# Altium schematic sheet Power_Regulation.SchDoc
size A3; CompanyName: Group 19 - AIgle; DrawnBy: Danny Huang; SheetNumber: 3; SheetTotal: 3
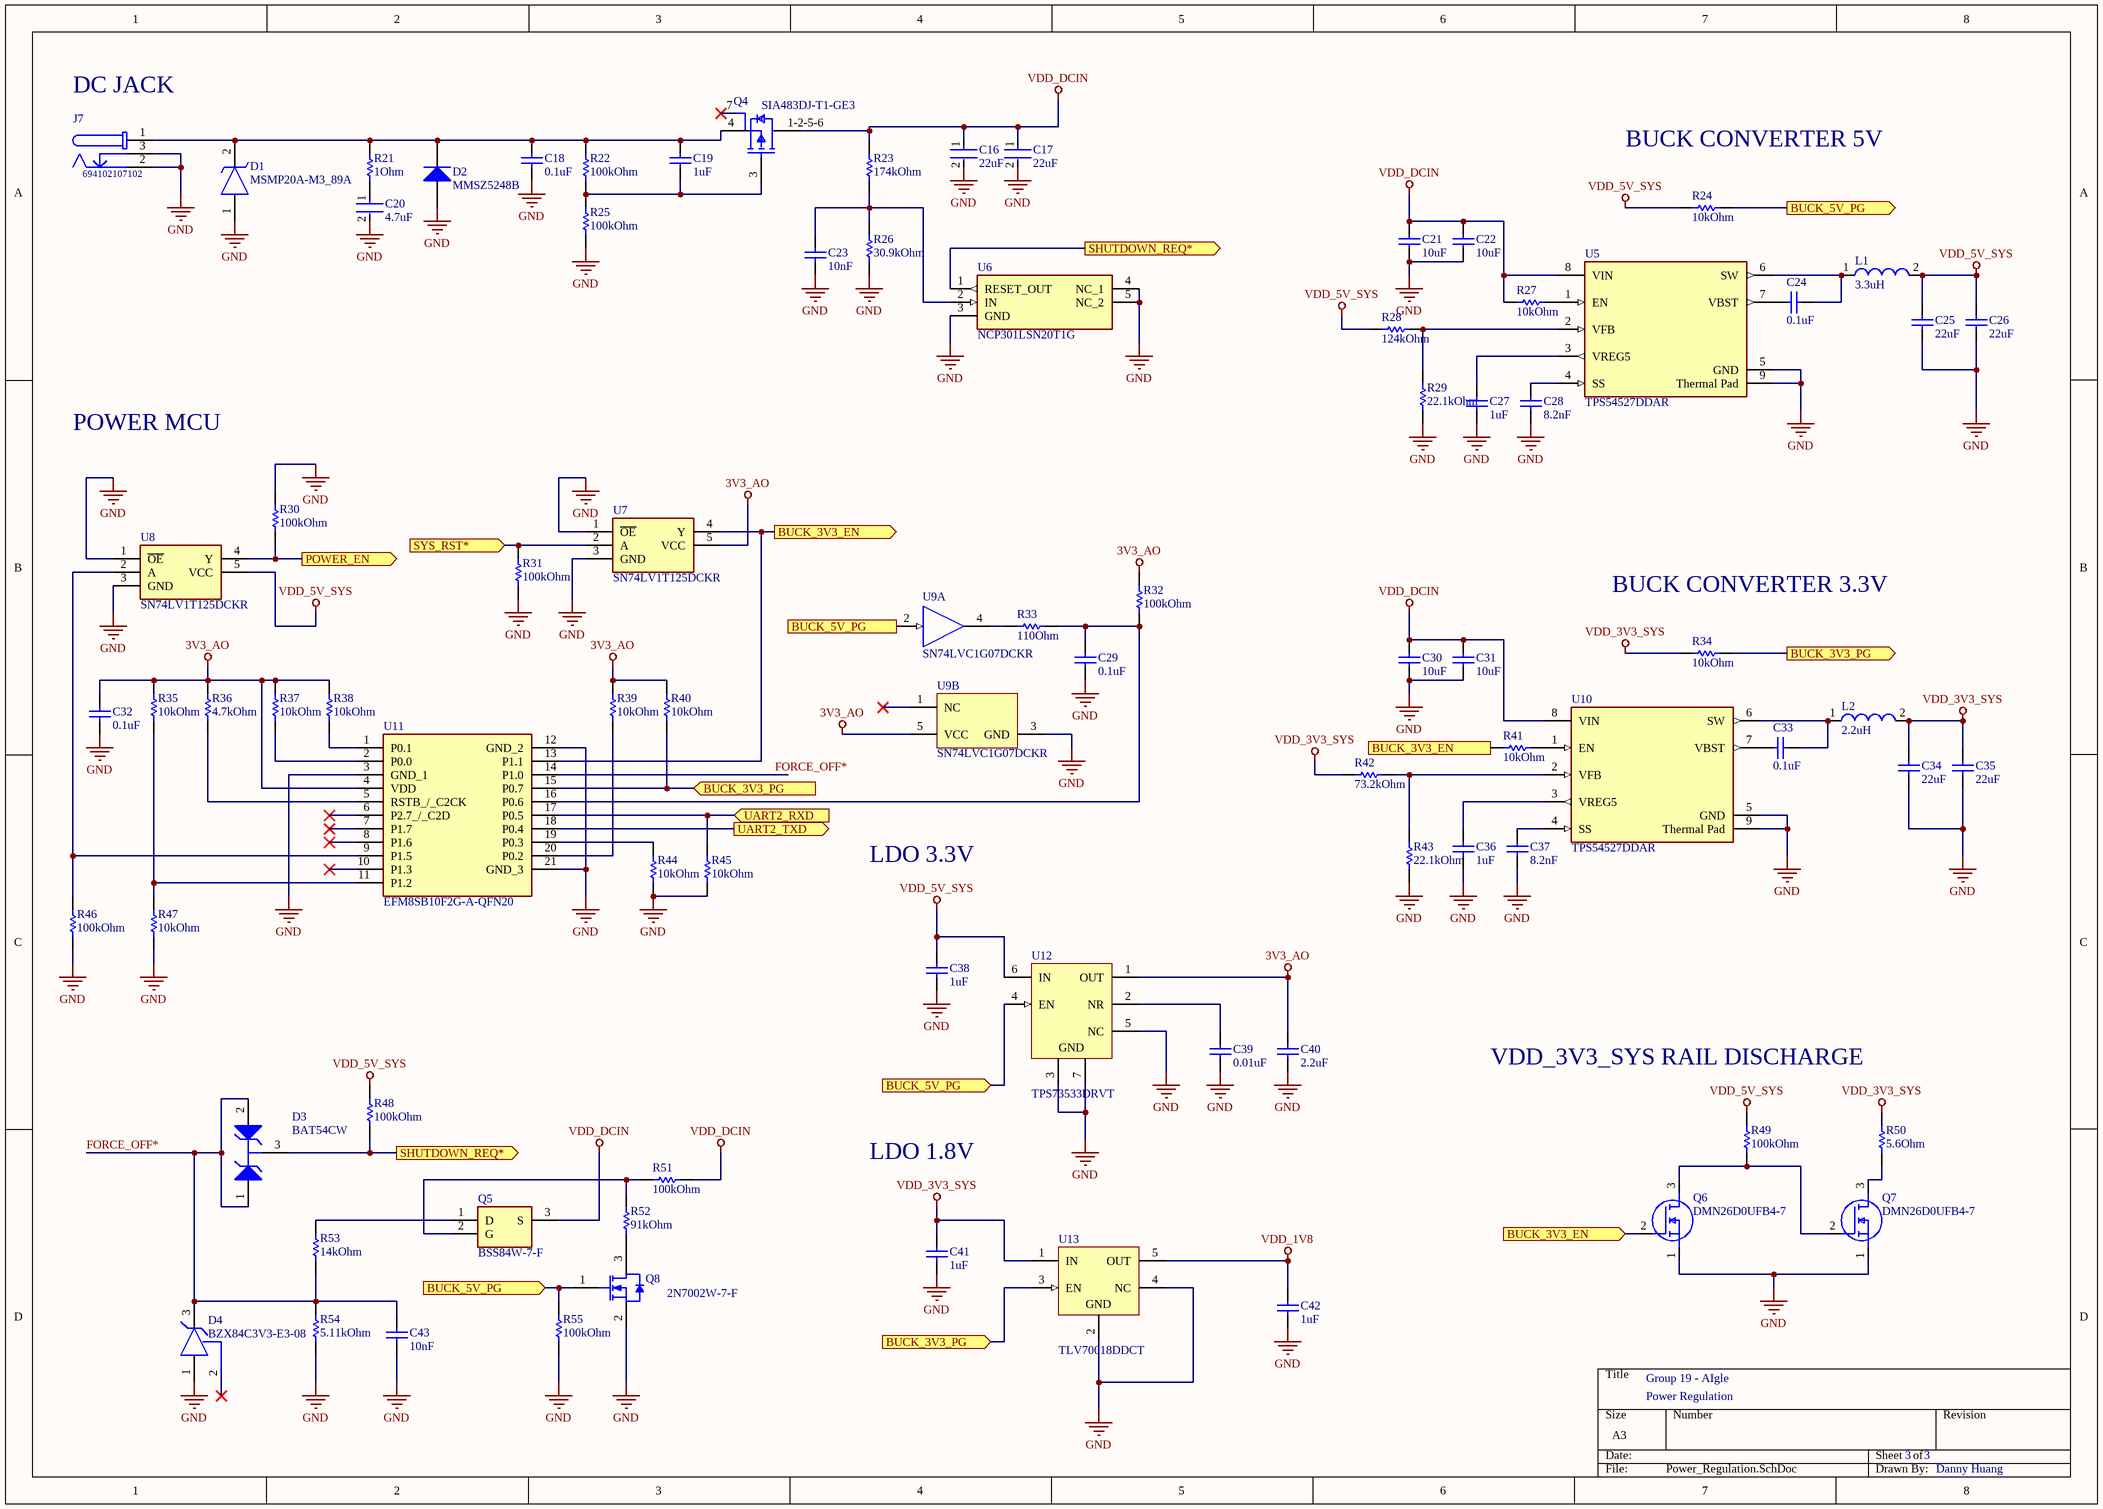
[diagram p0: Power_Regulation.SchDoc]

## Parts
C16  22uF  [FP-GRM21-0_2-MFG]
C17  22uF  [FP-GRM21-0_2-MFG]
C18  0.1uF  [CAPC1005X55X30NL05T10]
C19  1uF  [CAPC1608X90X35LL10T15]
C20  4.7uF  [FP-C0603-CG-MFG]
C21  10uF  [CAPC1608X90X35NL10T15]
C22  10uF  [CAPC1608X90X35NL10T15]
C23  10nF  [CAPC1005X55X30NL05T10]
C24  0.1uF  [CAPC1005X55X30NL05T10]
C25  22uF  [CAPC1608X100X20ML10]
C26  22uF  [CAPC1608X100X20ML10]
C27  1uF  [CAPC1005X60X30ML05T10]
C28  8.2nF  [CAPC1005X55X30ML05T10]
C29  0.1uF  [CAPC1005X55X30NL05T10]
C30  10uF  [CAPC1608X90X35NL10T15]
C31  10uF  [CAPC1608X90X35NL10T15]
C32  0.1uF  [CAPC1005X55X30NL05T10]
C33  0.1uF  [CAPC1005X55X30NL05T10]
C34  22uF  [CAPC1608X100X20ML10]
C35  22uF  [CAPC1608X100X20ML10]
C36  1uF  [CAPC1005X60X30ML05T10]
C37  8.2nF  [CAPC1005X55X30ML05T10]
C38  1uF  [CAPC1005X60X30ML05T10]
C39  0.01uF  [CAPC1005X55X30LL05T10]
C40  2.2uF  [CAPC1005X60X30NL05T10]
C41  1uF  [CAPC1005X60X30ML05T10]
C42  1uF  [CAPC1005X60X30ML05T10]
C43  10nF  [CAPC1005X55X30NL05T10]
D1  MSMP20A-M3_89A  [MICROSMP(ESMP)]
D2  MMSZ5248B  [FAIR-SOD-123-2_V]
D3  BAT54CW  [NXP-SOT323-3_L]
D4  BZX84C3V3-E3-08  [FP-6_541-5014_01-4-MFG]
J7  694102107102  [694102107102]
L1  3.3uH  [SMD 0806]
L2  2.2uH  [SMD 0805-Low profile]
Q4  SIA483DJ-T1-GE3  [FP-C-07431-MFG]
Q5  BSS84W-7-F  [SOT65P210X110-3N]
Q6  DMN26D0UFB4-7  [DMN26D0UFB47]
Q7  DMN26D0UFB4-7  [DMN26D0UFB47]
Q8  2N7002W-7-F  [DIOD-SOT323-3_V]
R21  1Ohm  [RESC1005X40X25ML05T05]
R22  100kOhm  [RESC1005X40X25ML05T05]
R23  174kOhm  [RESC1005X40X25LL05T05]
R24  10kOhm  [RESC1005X40X25NL05T05]
R25  100kOhm  [RESC1005X40X25ML05T05]
R26  30.9kOhm  [RESC1005X40X25LL05T05]
R27  10kOhm  [RESC1005X40X25NL05T05]
R28  124kOhm  [RESC1005X40X25ML05T05]
R29  22.1kOhm  [RESC1005X40X25ML05T05]
R30  100kOhm  [RESC1005X40X25ML05T05]
R31  100kOhm  [RESC1005X40X25ML05T05]
R32  100kOhm  [RESC1005X40X25ML05T05]
R33  110Ohm  [RESC1005X40X25LL05T05]
R34  10kOhm  [RESC1005X40X25NL05T05]
R35  10kOhm  [RESC1005X40X25NL05T05]
R36  4.7kOhm  [RESC1005X40X25ML05T05]
R37  10kOhm  [RESC1005X40X25NL05T05]
R38  10kOhm  [RESC1005X40X25NL05T05]
R39  10kOhm  [RESC1005X40X25NL05T05]
R40  10kOhm  [RESC1005X40X25NL05T05]
R41  10kOhm  [RESC1005X40X25NL05T05]
R42  73.2kOhm  [RESC1005X40X25ML05T05]
R43  22.1kOhm  [RESC1005X40X25ML05T05]
R44  10kOhm  [RESC1005X40X25NL05T05]
R45  10kOhm  [RESC1005X40X25NL05T05]
R46  100kOhm  [RESC1005X40X25ML05T05]
R47  10kOhm  [RESC1005X40X25NL05T05]
R48  100kOhm  [RESC1005X40X25ML05T05]
R49  100kOhm  [RESC1005X40X25ML05T05]
R50  5.6Ohm  [RESC1005X40X25ML05T05]
R51  100kOhm  [RESC1005X40X25ML05T05]
R52  91kOhm  [RESC1005X40X25ML05T05]
R53  14kOhm  [RESC1005X40X25LL05T05]
R54  5.11kOhm  [RESC1005X40X25LL05T05]
R55  100kOhm  [RESC1005X40X25ML05T05]
U5  TPS54527DDAR  [FP-DDA0008E-MFG]
U6  NCP301LSN20T1G  [SOT95P275X110-5N]
U7  SN74LV1T125DCKR  [SOT65P210X110-5N]
U8  SN74LV1T125DCKR  [SOT65P210X110-5N]
U9  SN74LVC1G07DCKR  [DCK0005A_M]  (parts A,B of 2)
U10  TPS54527DDAR  [FP-DDA0008E-MFG]
U11  EFM8SB10F2G-A-QFN20  [EFM8SB10F8GAQFN20R]
U12  TPS73533DRVT  [DRV0006A_V]
U13  TLV70018DDCT  [DDC0005A_L]

## Ports
BUCK_3V3_EN (in), BUCK_3V3_EN (out), BUCK_3V3_PG (in), BUCK_3V3_PG (out), BUCK_5V_PG (in), BUCK_5V_PG (out), POWER_EN (out), SHUTDOWN_REQ* (out), SYS_RST* (in), UART2_RXD (in), UART2_TXD (out)

## Nets
3V3_AO: C32.1 C40.2 R32.2 R35.2 R36.2 R37.2 R38.2 R39.2 R40.2 U7.5(VCC) U9.5(VCC) U11.4(VDD) U12.1(OUT)
GND: C16.2 C17.2 C18.2 C20.2 C21.1 C22.1 C23.1 C25.1 C26.1 C27.1 C28.1 C29.2 C30.1 C31.1 C32.2 C34.1 C35.1 C36.1 C37.1 C38.1 C39.1 C40.1 C41.1 C42.1 C43.1 D1.1(A) D2.1(A) D4.1(A) J7.2 J7.3 Q6.1(S) Q7.1(S) Q8.2(S) R25.2 R26.1 R29.1 R30.2 R31.1 R43.1 R44.1 R45.1 R46.1 R47.1 R54.1 R55.1 U5.5(GND) U5.9(Thermal_Pad) U6.3(GND) U6.4(NC_1) U6.5(NC_2) U7.1(~{OE}) U7.3(GND) U8.1(~{OE}) U8.3(GND) U9.3(GND) U10.5(GND) U10.9(Thermal_Pad) U11.3(GND_1) U11.12(GND_2) U11.21(GND_3) U12.3(GND) U12.5(NC) U12.7(GND) U13.2(GND) U13.4(NC)
VDD_1V8: C42.2 U13.5(OUT)
VDD_3V3_SYS: C34.2 C35.2 C41.2 L2.2 R34.2 R42.1 R50.2 U13.1(IN)
VDD_5V_SYS: C25.2 C26.2 C38.2 L1.2 R24.2 R28.1 R48.2 R49.2 U8.5(VCC) U12.6(IN)
VDD_DCIN: C16.1 C17.1 C21.2 C22.2 C30.2 C31.2 Q4.1-2-5-6(D) Q5.3(S) R23.2 R27.2 R51.1 U5.8(VIN) U10.8(VIN)
BUCK_3V3_EN: Q6.2(G) R41.2 U7.4(Y) U11.13(P1.1) ; port BUCK_3V3_EN
BUCK_3V3_PG: R34.1 R40.1 U11.15(P0.7) U13.3(EN) ; port BUCK_3V3_PG
BUCK_5V_PG: Q8.1(G) R24.1 R55.2 U9.2(A) U12.4(EN) ; port BUCK_5V_PG
FORCE_OFF*: C43.2 D3.1(A1) D3.2(A2) D4.3(C) R53.1 R54.2 U11.14(P1.0)
POWER_EN: R30.1 U8.4(Y) ; port POWER_EN
SHUTDOWN_REQ*: D3.3(K) R48.1 U6.1(RESET_OUT) ; port SHUTDOWN_REQ*
SYS_RST*: R31.2 U7.2(A) ; port SYS_RST*
UART2_RXD: R45.2 U11.17(P0.5) ; port UART2_RXD
UART2_TXD: U11.18(P0.4) ; port UART2_TXD
NetC18_1: C18.1 C19.2 D1.2(K) D2.2(K) J7.1 Q4.4(S) R21.2 R22.1
NetC19_1: C19.1 Q4.3(G) R22.2 R25.1
NetC20_1: C20.1 R21.1
NetC23_2: C23.2 R23.1 R26.2 U6.2(IN)
NetC24_1: C24.1 L1.1 U5.6(SW)
NetC24_2: C24.2 U5.7(VBST)
NetC27_2: C27.2 U5.3(VREG5)
NetC28_2: C28.2 U5.4(SS)
NetC29_1: C29.1 R32.1 R33.2 U11.16(P0.6)
NetC33_1: C33.1 L2.1 U10.6(SW)
NetC33_2: C33.2 U10.7(VBST)
NetC36_2: C36.2 U10.3(VREG5)
NetC37_2: C37.2 U10.4(SS)
NetC39_2: C39.2 U12.2(NR)
NetQ5_1: Q5.1(D) R53.2
NetQ5_2: Q5.2(G) R51.2 R52.2
NetQ6_3: Q6.3(D) Q7.2(G) R49.1
NetQ7_3: Q7.3(D) R50.1
NetQ8_3: Q8.3(D) R52.1
NetR27_1: R27.1 U5.1(EN)
NetR28_2: R28.2 R29.2 U5.2(VFB)
NetR33_1: R33.1 U9.4(Y)
NetR35_1: R35.1 R47.2 U11.11(P1.2)
NetR36_1: R36.1 U11.5(RSTB_/_C2CK)
NetR37_1: R37.1 U11.2(P0.0)
NetR38_1: R38.1 U11.1(P0.1)
NetR39_1: R39.1 U11.20(P0.2)
NetR41_1: R41.1 U10.1(EN)
NetR42_2: R42.2 R43.2 U10.2(VFB)
NetR44_2: R44.2 U11.19(P0.3)
NetR46_2: R46.2 U8.2(A) U11.9(P1.5)

Not connected (* = marked no-connect by the designer): D4 2(NC)*; Q4 7(S)*; U9 1(NC)*; U11 6(P2.7_/_C2D)* 7(P1.7)* 8(P1.6)* 10(P1.3)*

## Notes on the sheet
- (near J7) DC JACK
- BUCK CONVERTER 5V
- POWER MCU
- BUCK CONVERTER 3.3V
- LDO 3.3V
- VDD_3V3_SYS RAIL DISCHARGE
- LDO 1.8V
- Power Regulation

## Library data of the parts
C16 C17 = CMP-06035-000059-1: CAP CER 22UF 25V X5R 0805; Manufacturer Part Number: GRM21BR61E226ME44L; Manufacturer: Murata; Tolerance: 20%; Material: Ceramic; Temperature Coefficient: 15%; Value: 22uF; Temperature Range High: +85°C; Device Class L3: Ceramic Capacitors; Temperature: -55°C to +85°C; Voltage Rating: 25V; Digikey Description: CAP CER 22UF 25V X5R 0805; Package: GRM21-0.2; Capacitance: 22uF; Mouser Description: Multilayer Ceramic Capacitors MLCC - SMD/SMT 0805 22uF 25volts X5R 20%; Ipc Land Pattern Name: CAPC200125X125; Device Class L1: Passive Components; RoHS: TRUE; Height: 1.45mm; Temperature Range Low: -55°C; ComponentLink2Description: Datasheet; Category: Cap; Lead Free: Yes; Automotive: No; Temperature Characteristic: X5R; ComponentLink2URL: https://search.murata.co.jp/Ceramy/image/img/A01X/G101/ENG/GRM21BR61E226ME44-01A.pdf; Device Class L2: Capacitors; Octopart: https://octopart.com/grm21br61e226me44l-murata-20025355
C18 C24 C29 C32 C33 = CMP-2008-03087-1: Manufacturer: Kemet; Part Number: C0402C104K9RACTU
C19 = CMP-2006-02459-1: Manufacturer: Murata; Part Number: GRM188R61E105KA12D
C20 = CMP-03020-024641-1: CAP CER 4.7UF 6.3V X5R 0603; Manufacturer: Kemet; Manufacturer Part Number: C0603C475K9PACTU; Temperature Coefficient: 15%; Tolerance: 10%; Material: Ceramic; Device Class L3: Ceramic Capacitors; RoHS: TRUE; Value: 4.7uF; Lead Free: Yes; ComponentLink2Description: Datasheet; Mouser Description: Multilayer Ceramic Capacitors MLCC - SMD/SMT 6.3volts 4.7uF X5R 10%; Package: C0603-CG; Digikey Description: CAP CER 4.7UF 6.3V X5R 0603; ComponentLink2URL: https://content.kemet.com/datasheets/KEM_C1006_X5R_SMD.pdf; Category: Cap; Temperature Range Low: -55°C; Capacitance: 4.7uF; Temperature: -55°C to +85°C; Octopart: https://octopart.com/c0603c475k9pactu-kemet-104242; Ipc Land Pattern Name: CAPC16080X80; Voltage Rating: 6.3V; Temperature Range High: +85°C; Height: 0.9mm; Temperature Characteristic: X5R; Device Class L1: Passive Components; Automotive: No; Device Class L2: Capacitors
C21 C22 C30 C31 = CMP-2006-02792-1: Part Number: GRM188R60J106ME47D; Manufacturer: Murata
C23 C43 = CMP-2008-03072-1: Manufacturer: Kemet; Part Number: C0402C103K4RACTU
C25 C26 C34 C35 = CMP-2000-05440-1: Chip Capacitor, 22 uF, +/- 20%, 6.3 V, -55 to 85 degC, 1608 (0603 Metric), RoHS, Tape and Reel; PCN Part Number: MLCCPartNumberChange30/Nov/2012; Manufacturer: TDK; Temperature Coefficient: X5R; Product Training Modules: CSeriesGeneralApplicationsSEAT,CCV,andTVCLDesignToolsGuidetoReplacinganElectrolyticCapacitorwithanMLCC; Other Names: 445-8028-1; Capacitance: 22µF; Voltage - Rated: 6.3V; Design Resources: 20WNon-IsolatedBuckLEDDriverUsingPLLNK460KG; Online Catalog: CSeries,GeneralPurpose; Kits: 445-9003-KIT-ND-KITCAPCERHICAPMLCCSMD; Tolerance: ±20%; Series: C; Thickness (Max): 0.039"(1.00mm); Mounting Type: SurfaceMount,MLCC; Ratings: -; Datasheet Version: Mar-15; Package Reference: 603; Packaging: CutTape(CT); Features: -; Package / Case: 0603(1608Metric); Family: CeramicCapacitors; Lead Spacing: -; RoHS Information: RoHSCertificate-MLCC; Manufacturer URL: http://www.tdk.com/; Lead Style: -; Category: Capacitors; Applications: GeneralPurpose; Package Description: 2-Pin Surface Mount Device, Body 1.6 x 0.8 mm; Standard Package: 1; Datasheet URL: http://www.farnell.com/datasheets/1913358.pdf; Height - Seated (Max): -; Operating Temperature: -55degC~85degC; Size / Dimension: 0.063"Lx0.031"W(1.60mmx0.80mm)
C27 C36 C38 C41 C42 = CMP-2008-02075-1: Part Number: C0402C105K9PAC7867; Manufacturer: Kemet
C28 C37 = CMP-2008-03262-1: Part Number: C0402C822K5RACTU; Manufacturer: Kemet
C39 = CMP-2008-03076-1: Manufacturer: Kemet; Part Number: C0402C103K9RACTU
C40 = CMP-2008-02055-1: Part Number: C0402C225K9PACTU; Manufacturer: Kemet
D1 = MSMP20A-M3_89A: TVS Diode (Uni-directional); Manufacturer_Name: Vishay; Manufacturer_Part_Number: MSMP20A-M3/89A; Datasheet Link: https://www.vishay.com/docs/89457/msmp6athrumsmp20a.pdf; Arrow Part Number: MSMP20A-M3/89A; Arrow Price/Stock: https://www.arrow.com/en/products/msmp20a-m389a/vishay; Mouser Part Number: 78-MSMP20A-M389A; Mouser Price/Stock: https://www.mouser.com/Search/Refine.aspx?Keyword=78-MSMP20A-M389A
D2 = CMP-2000-06744-1: Zener Diode, 18 V, -55 to 150 degC, 2-Pin SOD-123, RoHS, Tape and Reel; Manufacturer: FairchildSemiconductor; Manuf. Code: FSC; Residual reverse leakage current: 0.1µA; Max. power: 500mW; Enclosure: SOD123; Impedance reference: 7mA; Configuration: 1diode; Uz(min.): 17.1V; Forward voltage reference: 10mA; UF: 900mV; Zener voltage: 18V; Uz (max.): 18.9V; Impedance: 21Ω; Category: Zenerdiode; Package Description: 2-Pin Surface Mount Device, Body 2.7 x 1.6 mm; Type: MMSZ5248B; Manufacturer URL: https://www.fairchildsemi.com/; Operating temperature (min.): -55°C; Datasheet URL: https://www.fairchildsemi.com/datasheets/MM/MMSZ5226B.pdf; Mounting type: Surface-mount; Max. operating temperature: +150°C; Mounting Technology: SurfaceMount; Datasheet Version: Rev. 1.6, 10/2015; Package Reference: SOD-123-2
D3 = CMP-0417-00001-1: SOT-323 Plastic-Encapsulated Diode; Manufacturer: NXP Semiconductors; Non-repetitive Peak Reverse Current: 600 mA; Max Forward Current: 200 mA; PackageVersion: Mar-06; ComponentLink3URL: http://www.nxp.com/documents/outline_drawing/sot323_po.pdf; Mounting Technology: Surface Mount; ComponentLink3Description: Package Specification; ComponentLink2Description: Datasheet; PartNumber: BAT54CW; Storage Temperature: -65 to 150 degC; DatasheetVersion: Rev. 3, 11/2012; ComponentLink2URL: http://www.nxp.com/documents/data_sheet/BAT54W_SER.pdf; ComponentLink1Description: Manufacturer URL; ComponentLink1URL: http://www.nxp.com/; PackageDescription: 3-Pin SOT323, 2 x 1.3 mm Body, 0.65 mm Pitch; PackageReference: SOT323-3
D4 = CMP-02541-000017-1: DIODE ZENER 3.3V 300MW SOT23; Manufacturer: Vishay; Reverse Voltage: 1V; Zener Impedance: 95Ω; Max Junction Temp: +150°C; Max Zener Voltage: 3.5V; Max Reverse Leakage Current: 5uA; Device Class L1: Discrete Semiconductors; Digikey Description: DIODE ZENER 3.3V 300MW SOT23; ComponentLink2URL: http://www.vishay.com/docs/85763/bzx84v.pdf; Lead Free: Yes; Package: 6.541-5014.01-4; Automotive: No; Device Class L3: Zener Diodes; Mouser Description: Zener Diodes 3.3 Volt 0.35W 5%; Temperature Range Low: -55°C; Nom Zener Voltage: 3.3V; Manufacturer Part Number: BZX84C3V3-E3-08; Octopart: https://octopart.com/bzx84c3v3-e3-08-vishay-30324846; RoHS: TRUE; Device Class L2: Diodes; Category: Diode; Temperature Range High: +150°C; Temperature: -55°C to +150°C; Height: 1.15mm; ComponentLink2Description: Datasheet; Power Dissipation: 300mW
J7 = CMP-1502-00174-1: DC Power Jack Connector Low Profile with 4 soldering pads & Pegs WR-DC, Male, Right Angled, SMT, 5 A, 18 V; Manufacturer: Wurth Elektronik; Working Voltage: 18V; Rated Current: 5A; Plug Outer Diameter: 3.5mm; Plug Inner Diameter: 1.05mm; Opening Diameter: 3.9mm; Manufacturer URL: http://www.we-online.de; Publisher: WurthElektronik; Gender: Male; Mounting Technology: SMT; Packaging: TapeandReel; Package Reference: 694102107102; Part Number: 694102107102; Operating Temperature: -40to85degC; Datasheet URL: http://katalog.we-online.de/em/datasheet/6941xx107102.pdf; Orientation: RightAngled
L1 = CMP-1392-00058-1: Power Multilayer Inductor WE-PMI, L=3.30 µH; PartNumber: 74479776233; Manufacturer: Wuerth Elektronik; Inductance: 3.30 ÂµH; ComponentLink2URL: http://katalog.we-online.de/kataloge/eisos/media/pdf/74479776233A.pdf; ComponentLink1URL: http://www.we-online.com; PackageReference: SMD 0806; ComponentLink1Description: Manufacturer URL; ComponentLink2Description: Datasheet
L2 = CMP-1392-00044-1: Power Multilayer Inductor WE-PMI, L=2.20 µH; Manufacturer: Wuerth Elektronik; PartNumber: 74479774222; Inductance: 2.20 ÂµH; ComponentLink2Description: Datasheet; ComponentLink1Description: Manufacturer URL; PackageReference: SMD 0805-Low profile; ComponentLink1URL: http://www.we-online.com; ComponentLink2URL: http://katalog.we-online.de/kataloge/eisos/media/pdf/74479774222.pdf
Q4 = CMP-02550-000185-1: MOSFET P-CH 30V 12A SC70-6; Manufacturer: Vishay; Number Of Channels: 1; Reverse Recovery Charge: 10nC; Threshold Vgs Min: -1V; Turn On Delay Time: 10ns; Drain To Source Voltage: -30V; Input Capacitace At Vds: 1550pF @ -15V; Reverse Recovery Time: 17ns; Turn Off Delay Time: 27ns; Pulse Drain Current: -40A; Drain To Source Resistance: 0.016Ω; Typ Forward Diode Voltage: -0.8V; Gate Charge At Vgs: 29nC @ -10V; Continuous Drain Current: -10A; Max Junction Temp: +150°C; Threshold Vgs Max: -2.2V; Rthja Max: 28°C/W; Gate To Source Voltage: 20V; Depletion Mode: False; Power Dissipation: 3.5W; Max Forward Diode Voltage: -1.2V; Transconductance: 23S; Standoff Height: 0mm; Octopart: https://octopart.com/sia483dj-t1-ge3-vishay-45727624; RoHS: TRUE; Device Class L3: MOSFETs; Drain To Source Breakdown Voltage: -30V; Automotive: No; Digikey Description: MOSFET P-CH 30V 12A SC70-6; Temperature Range High: +150°C; Temperature: -55°C to +150°C; Package: C-07431; Category: Trans; Height: 0.8mm; Lead Free: Yes; Device Class L1: Discrete Semiconductors; Number Of P Channels: 1; Mouser Description: MOSFET -30V 21mOhm@10V 12A P-Ch G-III; Temperature Range Low: -55°C; Device Class L2: Transistors; ComponentLink2URL: http://www.vishay.com/docs/62779/sia483dj.pdf; Manufacturer Part Number: SIA483DJ-T1-GE3; ComponentLink2Description: Datasheet
Q5 = BSS84W-7-F: Undefined or Miscellaneous; Manufacturer_Name: Diodes Inc.; Datasheet Link: http://componentsearchengine.com/Datasheets/1/BSS84W-7-F.pdf; Manufacturer_Part_Number: BSS84W-7-F; Arrow Part Number: BSS84W-7-F; Arrow Price/Stock: https://www.arrow.com/en/products/bss84w-7-f/diodes-incorporated; Mouser Part Number: 621-BSS84W-F; Mouser Price/Stock: https://www.mouser.co.uk/ProductDetail/Diodes-Incorporated/BSS84W-7-F?qs=C%2FiXDRqWM5gURToIay7bAQ%3D%3D
Q6 Q7 = DMN26D0UFB4-7: MOSFET (N-Channel); Manufacturer_Name: Diodes Inc.; Datasheet Link: https://componentsearchengine.com/Datasheets/1/DMN26D0UFB4-7.pdf; Height: 0.4mm; Manufacturer_Part_Number: DMN26D0UFB4-7; Arrow Part Number: DMN26D0UFB4-7; Arrow Price/Stock: https://www.arrow.com/en/products/dmn26d0ufb4-7/diodes-incorporated; Mouser Part Number: 621-DMN26D0UFB4-7; Mouser Price/Stock: https://www.mouser.co.uk/ProductDetail/Diodes-Incorporated/DMN26D0UFB4-7?qs=GWgl%252BsiMZr%252B4pznsTuF3iQ%3D%3D
Q8 = CMP-2000-05568-1: N-Channel Enhancement Mode Field Effect Transistor, 60 V (VDS), 0.115 A (IDS), -55 to 150 degC, 3-Pin SOT323, RoHS, Tape and Reel; Manufacturer: DiodesIncorporated; Typical Turn-On Delay Time: 7ns; Configuration: Single; Id - Continuous Drain Current: 115mA; Transistor Type: 1N-Channel; Vgs - Gate-Source Voltage: 20V; Pd - Power Dissipation: 200mW; Unit Weight: 0.000212oz; Rds On - Drain-Source Resistance: 2.6Ohms; Forward Transconductance - Min: 0.08S; Number of Channels: 1Channel; Vds - Drain-Source Breakdown Voltage: 70V; Typical Turn-Off Delay Time: 11ns; Series: 2N7002; Transistor Polarity: N-Channel; Technology: Si; Product: MOSFETSmallSignal; Channel Mode: Enhancement; Datasheet URL: http://www.diodes.com/_files/datasheets/ds30099.pdf; Mounting Style: SMD/SMT; Packaging: Reel; Datasheet Version: Rev. 14-2, 09/2013; Package / Case: SOT-323-3; Length: 2.2mm; Manufacturer URL: http://www.diodes.com/; Height: 1mm; Factory Pack Quantity: 3000; Maximum Operating Temperature: +150C; Product Category: MOSFET; Minimum Operating Temperature: -55C; Type: EnhancementModeFieldEffectTransistor; Package Description: 3-Pin Small Outline Transistor, Body 2 x 1.25 mm, Pitch 0.65 mm; Width: 1.35mm; RoHS: True; Package Reference: SOT323; Mounting Technology: SurfaceMount; Brand: DiodesIncorporated
R21 = CMP-2002-08342-1: Part Number: CRCW04021R00FKED; Manufacturer: Vishay Dale
R22 R25 R30-R32 R46 R48 R49 R51 R55 = CMP-2002-08123-2: Chip Resistor, 100 KOhm, +/- 1%, 0.63 W, -55 to 155 degC, 0402 (1005 Metric), RoHS, Tape and Reel; Voltage Rating: 50 V; Type (Resistor): Thick Film; Power Rating: 63 mW; Case\Package: 0402; Mount: Surface Mount; Packaging: Tape and Reel; Weight: 2.3E-05 oz; PackageDescription: 2-Pin Surface Mount Device, Body 1 x 0.5 mm; ComponentLink1Description: Manufacturer URL; ComponentLink2Description: Datasheet; Min Operating Temperature: -55 degC; Width: 0.5 mm; Resistance: 100 kohm; REACH SVHC: Unknown; ComponentLink2URL: http://www.vishay.com/docs/20035/dcrcwe3.pdf; Package Quantity: 10000; Mounting Technology: Surface Mount; PackageReference: 0402; ComponentLink1URL: http://www.vishay.com/; Max Operating Temperature: 155 degC; Length: 1 mm; DatasheetVersion: 06/2012; Height: 0.35 mm; Case Code (Imperial): 0402; Pins: 2; Tolerance: 1%; Case Code (Metric): 1005; Radiation Hardening: No; RoHSCompliant: true
R23 = CMP-2002-08244-1: Manufacturer: Vishay Dale; Part Number: CRCW0402174KFKED
R24 R27 R34 R41 = CMP-2002-08136-1: Manufacturer: Vishay Dale; Part Number: CRCW040210K0JNED
R26 = CMP-2002-08508-1: Part Number: CRCW040230K9FKED; Manufacturer: Vishay Dale
R28 = CMP-2002-08173-1: Manufacturer: Vishay Dale; Part Number: CRCW0402124KFKED
R29 R43 = CMP-2002-08380-1: Manufacturer: Vishay Dale; Part Number: CRCW040222K1FKED
R33 = CMP-2002-08151-1: Part Number: CRCW0402110RJNED; Manufacturer: Vishay Dale
R35 R37-R40 R44 R45 R47 = CMP-2002-08135-1: Manufacturer: Vishay Dale; Part Number: CRCW040210K0FKED
R36 = CMP-2002-00053-1: Part Number: CRCW04024K70JNED; Manufacturer: Vishay BCcomponents
R42 = CMP-2002-00203-1: Part Number: CRCW040273K2FKED; Manufacturer: Vishay Dale
R50 = CMP-2002-00563-1: Part Number: ERJ-2GEJ5R6X; Manufacturer: Panasonic
R52 = CMP-2002-00271-1: Manufacturer: Vishay Dale; Part Number: CRCW040291K0JNED
R53 = CMP-2002-08207-1: Manufacturer: Vishay Dale; Part Number: CRCW040214K0FKED
R54 = CMP-2002-00117-1: Manufacturer: Vishay Dale; Part Number: CRCW04025K11FKED
U5 U10 = CMP-04918-000091-1: IC REG BUCK ADJUSTABLE 5A 8SOPWR; Manufacturer: Texas Instruments; Output Voltage: 0.76-6V; Min Supply Voltage: 4.5V; Switching Frequency: 650kHz; Number Of Outputs: 1; Output Type: AdjustableProgrammable; Max Duty Cycle: 85%; Standoff Height: 0mm; Max Junction Temp: +150°C; Nominal Supply Current: 900uA; Output Current: 5mA; Max Supply Voltage: 18V; Package: DDA0008E; Device Class L2: Power Management ICs; Device Class L3: Voltage Regulators - Switching; Ambient Temperature Range Low: -40°C; Ambient Temperature Range High: +85°C; Switching Topology: Buck; Ipc Land Pattern Name: SOP127P600X170-8; Automotive: No; Lead Free: Yes; Digikey Description: IC REG BUCK ADJUSTABLE 5A 8SOPWR; Manufacturer Part Number: TPS54527DDAR; Category: IC; RoHS: TRUE; ComponentLink2Description: Datasheet; ComponentLink2URL: http://www.ti.com/lit/ds/symlink/tps54527.pdf; Temperature: -40°C to +85°C; Octopart: https://octopart.com/tps54527ddar-texas+instruments-20362751; Temperature Range High: +85°C; Temperature Range Low: -40°C; Height: 1.7mm; Mouser Description: 4.5V to 18V Input, 5-A Synchronous Step-Down Converter 8-SO PowerPAD -40 to 85; Device Class L1: Integrated Circuits (ICs)
U6 = NCP301LSN20T1G: Integrated Circuit; Manufacturer_Name: ON Semiconductor; Datasheet Link: http://www.onsemi.com/pub/Collateral/NCP300-D.PDF; Height: 1.1mm; Manufacturer_Part_Number: NCP301LSN20T1G; Arrow Part Number: NCP301LSN20T1G; Arrow Price/Stock: https://www.arrow.com/en/products/ncp301lsn20t1g/on-semiconductor; Mouser Part Number: 863-NCP301LSN20T1G; Mouser Price/Stock: https://www.mouser.co.uk/ProductDetail/ON-Semiconductor/NCP301LSN20T1G?qs=%2FugrpAKHX8q7C9Mzamhz3w%3D%3D
U7 U8 = SN74LV1T125DCKR: Integrated Circuit; Manufacturer_Name: Texas Instruments; Datasheet Link: http://www.ti.com/lit/gpn/sn74lv1t125; Height: 1.1mm; Manufacturer_Part_Number: SN74LV1T125DCKR; Arrow Part Number: SN74LV1T125DCKR; Arrow Price/Stock: https://www.arrow.com/en/products/sn74lv1t125dckr/texas-instruments; Mouser Part Number: 595-SN74LV1T125DCKR; Mouser Price/Stock: https://www.mouser.co.uk/ProductDetail/Texas-Instruments/SN74LV1T125DCKR?qs=8sOby8ZxZLEEpIbhoTKj7w%3D%3D
U9 = CMP-0859-00290-3: Single Buffer/Driver With Open-Drain Output, DCK0005A, LARGE T&R; Manufacturer: Texas Instruments; 3-State Output: No; F @ Nom Voltage(Max)(Mhz): 150; ICC @ Nom Voltage(Max)(mA): 0.01; VCC(Min)(V): 1.65; Logic: True; Sub-Family: Non-Inverting Buffer/Driver; Output Drive (IOL/IOH)(Max)(mA): 32/-32; Input Type: CMOS/TTL; Technology Family: LVC; Bits(#): 1; VCC(Max)(V): 5.5; Output Type: CMOS; tpd @ Nom Voltage(Max)(ns): 8.6,6,4.7,4; Rating: Catalog; Voltage(Nom)(V): 1.8,2.5,3.3,5; Generic Part Number: SN74LVC1G07; PackageReference: DCK0005A; DatasheetVersion: SCES296AC; Operating Temperature Range(C): -40 to 125,-40 to 85; Schmitt Trigger: No
U11 = EFM8SB10F2G-A-QFN20: Integrated Circuit; Manufacturer_Name: Silicon Labs; Datasheet Link: https://www.silabs.com/documents/public/data-sheets/efm8sb1-datasheet.pdf; Height: 0.6mm; Manufacturer_Part_Number: EFM8SB10F2G-A-QFN20; Arrow Part Number: EFM8SB10F2G-A-QFN20; Arrow Price/Stock: https://www.arrow.com/en/products/efm8sb10f2g-a-qfn20/silicon-labs; Mouser Part Number: 634-8SB10F2GAQF20; Mouser Price/Stock: https://www.mouser.co.uk/ProductDetail/Silicon-Labs/EFM8SB10F2G-A-QFN20?qs=DCjbIwhU0Zv4HMgdSm4N7w%3D%3D
U12 = CMP-0395-00672-2: Single Output High PSRR LDO, 500 mA, Fixed 3.3 V Output, 2.7 to 6.5 V Input, with Low IQ, 6-pin SON (DRV), -40 to 125 degC, Green (RoHS & no Sb/Br); Manufacturer: Texas Instruments; Iout(Max)(A): 0.5; Vin(Max)(V): 6.5; Vin(Min)(V): 2.7; SubFamily: Single Channel LDO; Fixed Output Options(V): 3.3; Accuracy(%): 2; Vdo(Typ)(mV): 280; Iq(Typ)(mA): 0.04; ComponentLink3URL: http://www.ti.com/litv/pdf/mpds216d; PartNumber: TPS73533DRVT; ComponentLink2Description: Datasheet; DatasheetVersion: SBVS087J; ComponentLink3Description: Package Specification; Vout Adj(Min)(V): 3.3; Eco-Plan: Green (RoHS & no Sb/Br); ComponentLink1URL: http://www.ti.com/; Vout Adj(Max)(V): 3.3; PackageDescription: 6-Pin Plastic Small Outline No-Lead, Body 2 x 2 mm, Pitch 0.65 mm; ComponentLink2URL: http://www.ti.com/general/docs/lit/getliterature.tsp?genericPartNumber=TPS73533&fileType=pdf; PackageVersion: 4206925/E; Mounting Technology: Surface Mount; PackageReference: DRV0006A; ComponentLink1Description: Manufacturer URL
U13 = CMP-0394-01053-2: Single Output LDO, 200 mA, Fixed 1.8 V Output, 2 to 5.5 V Input, with Low IQ, 5-pin SOT (DDC), -40 to 125 degC, Green (RoHS & no Sb/Br); Manufacturer: Texas Instruments; Fixed Output Options(V): 1.8; Vin(Min)(V): 2; SubFamily: Single Channel LDO; Vin(Max)(V): 5.5; Vdo(Typ)(mV): 175; Iout(Max)(A): 0.2; Iq(Typ)(mA): 0.03; ComponentLink3Description: Package Specification; ComponentLink3URL: http://www.ti.com/litv/pdf/mpds123d; PackageReference: DDC0005A; ComponentLink2Description: Datasheet; Code_JEDEC: MO-193; PackageVersion: 4204403-2/E; Vout Adj(Max)(V): 1.8; PackageDescription: 5-Pin Plastic Small Outline, Body 2.9 x 1.6 mm, 0.95 mm Pitch; ComponentLink1Description: Manufacturer URL; Eco-Plan: Green (RoHS & no Sb/Br); Accuracy(%): 2; ComponentLink2URL: http://www.ti.com/general/docs/lit/getliterature.tsp?genericPartNumber=TLV70018&fileType=pdf; DatasheetVersion: SLVSA00D; Vout Adj(Min)(V): 1.8; Mounting Technology: Surface Mount; ComponentLink1URL: http://www.ti.com/; PartNumber: TLV70018DDCT